# EAGLE schematic ECE445-Transmitter-Schematic-V-Converter (EAGLE 7.5.0)
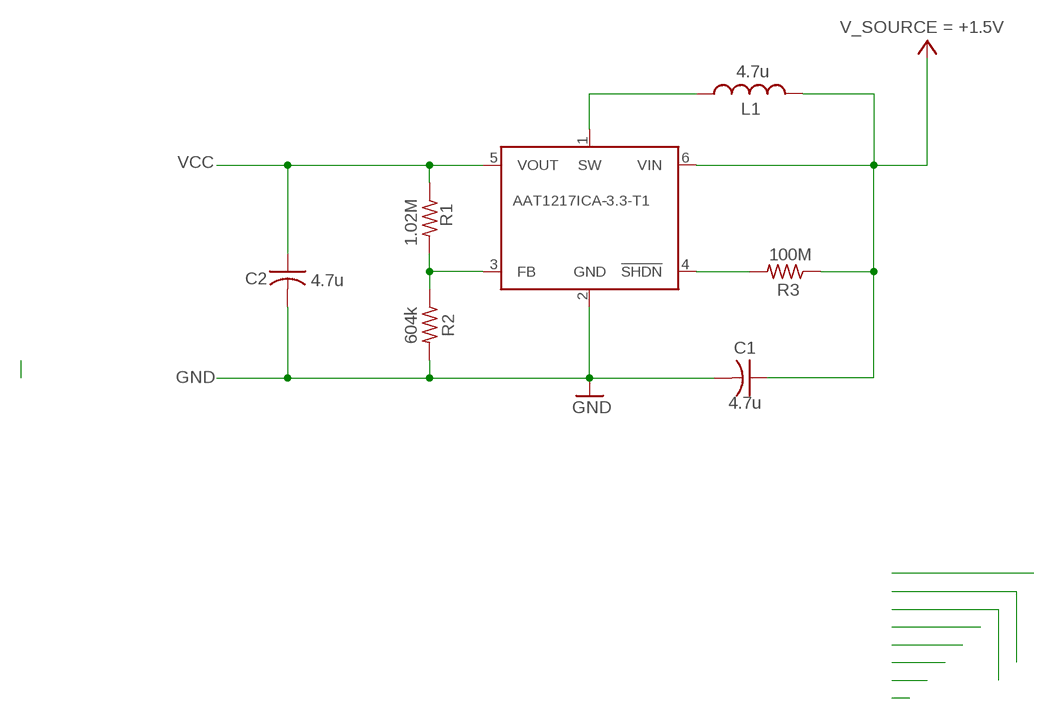
[diagram p0: schematic, sheet 1]

## Parts
-  AAT1217ICA-3.3-T1  [TSOT-23-6]
C1  4.7u  C-US025-024X044  [C025-024X044]
C2  4.7u  C-US025-024X044  [C025-024X044]
L1  4.7u  L-US0204/5  [0204/5]
R1  1.02M  R-US_0204/2V  [0204V]
R2  604k  R-US_0204/2V  [0204V]
R3  100M  R-US_0204/2V  [0204V]

## Nets
+3V3: -.6(VIN) C1.1 L1.2 R3.1 ; supply symbol labelled V_SOURCE = +1.5V
GND: -.2(GND) C1.2 C2.2 R2.2
N$1: -.1(SW) L1.1
N$5: -.3(FB) R1.2 R2.1
N$19: -.4(!SHDN) R3.2
VCC: -.5(VOUT) C2.1 R1.1

## Library data of the parts
- = Skyworks:AAT1217
C1 C2 = rcl:C-US: CAPACITOR, American symbol
L1 = rcl:L-US: INDUCTOR, American symbol
R1-R3 = rcl:R-US_: RESISTOR, American symbol